# EasyEDA Pro project ProPrj_25电赛_2025-07-31.epro, board PCB1
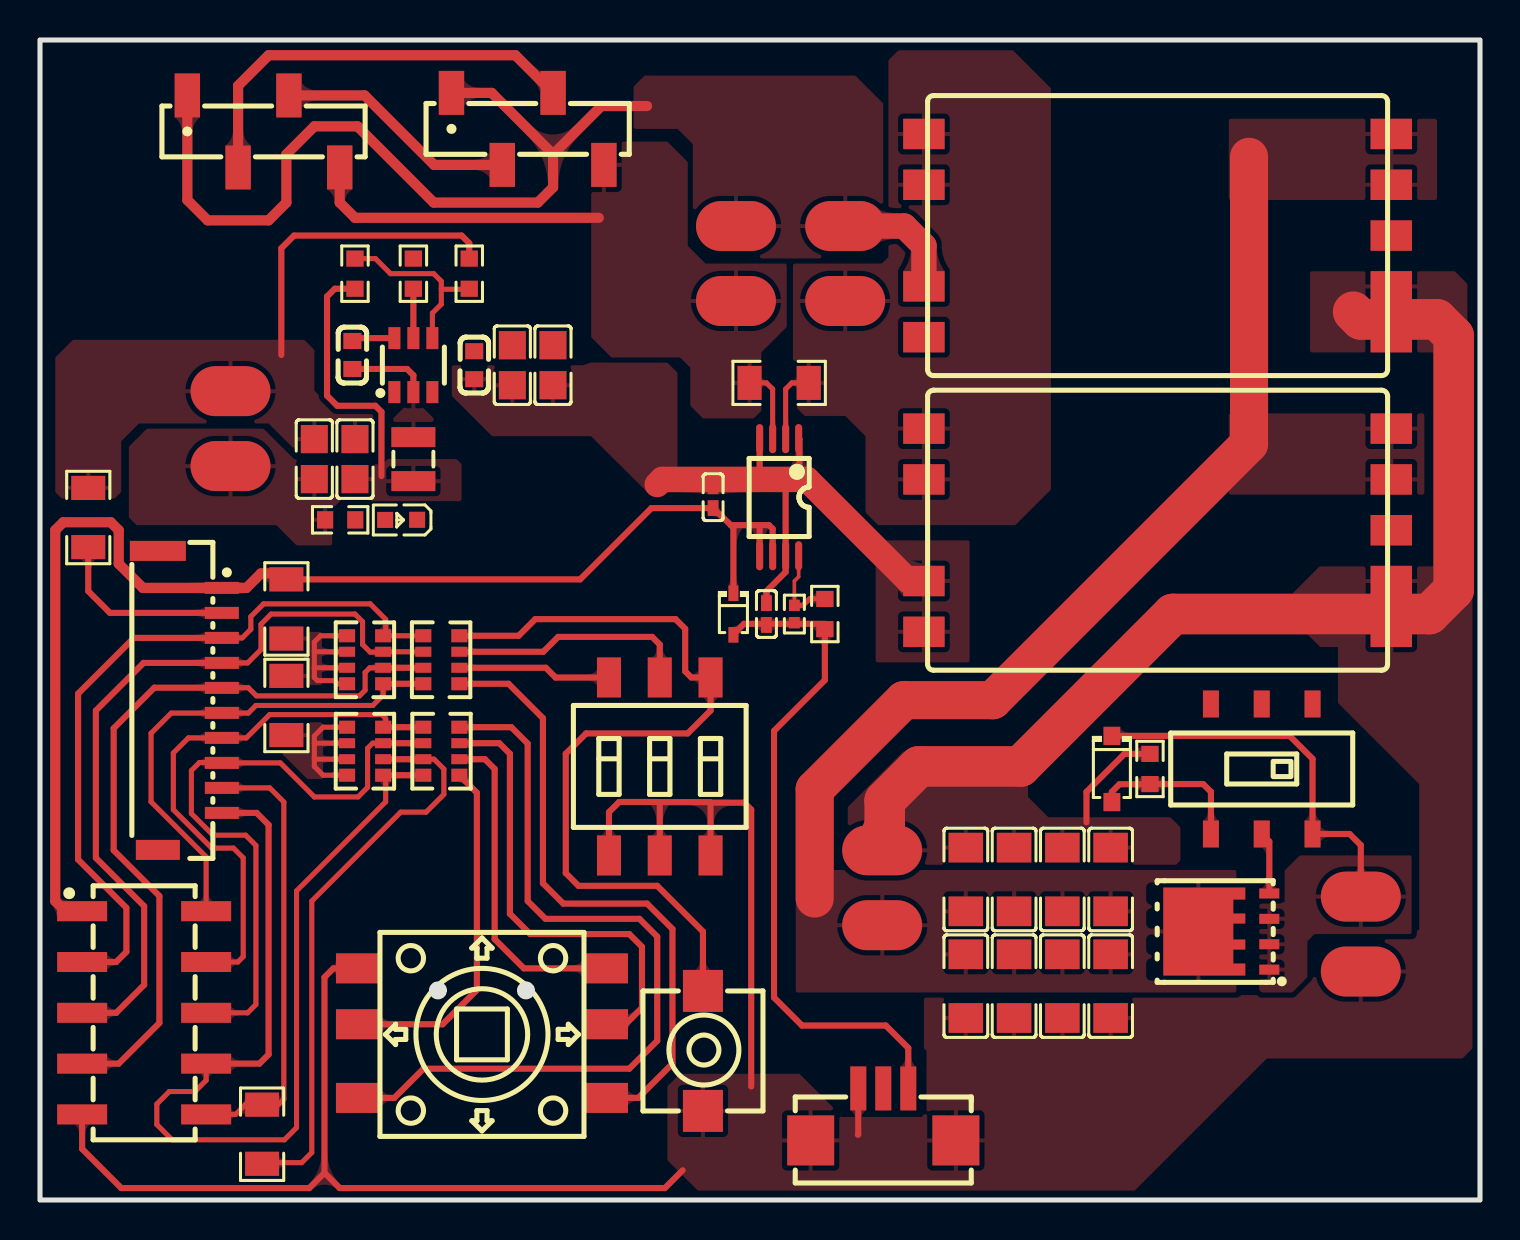
[diagram p3: board, top side]
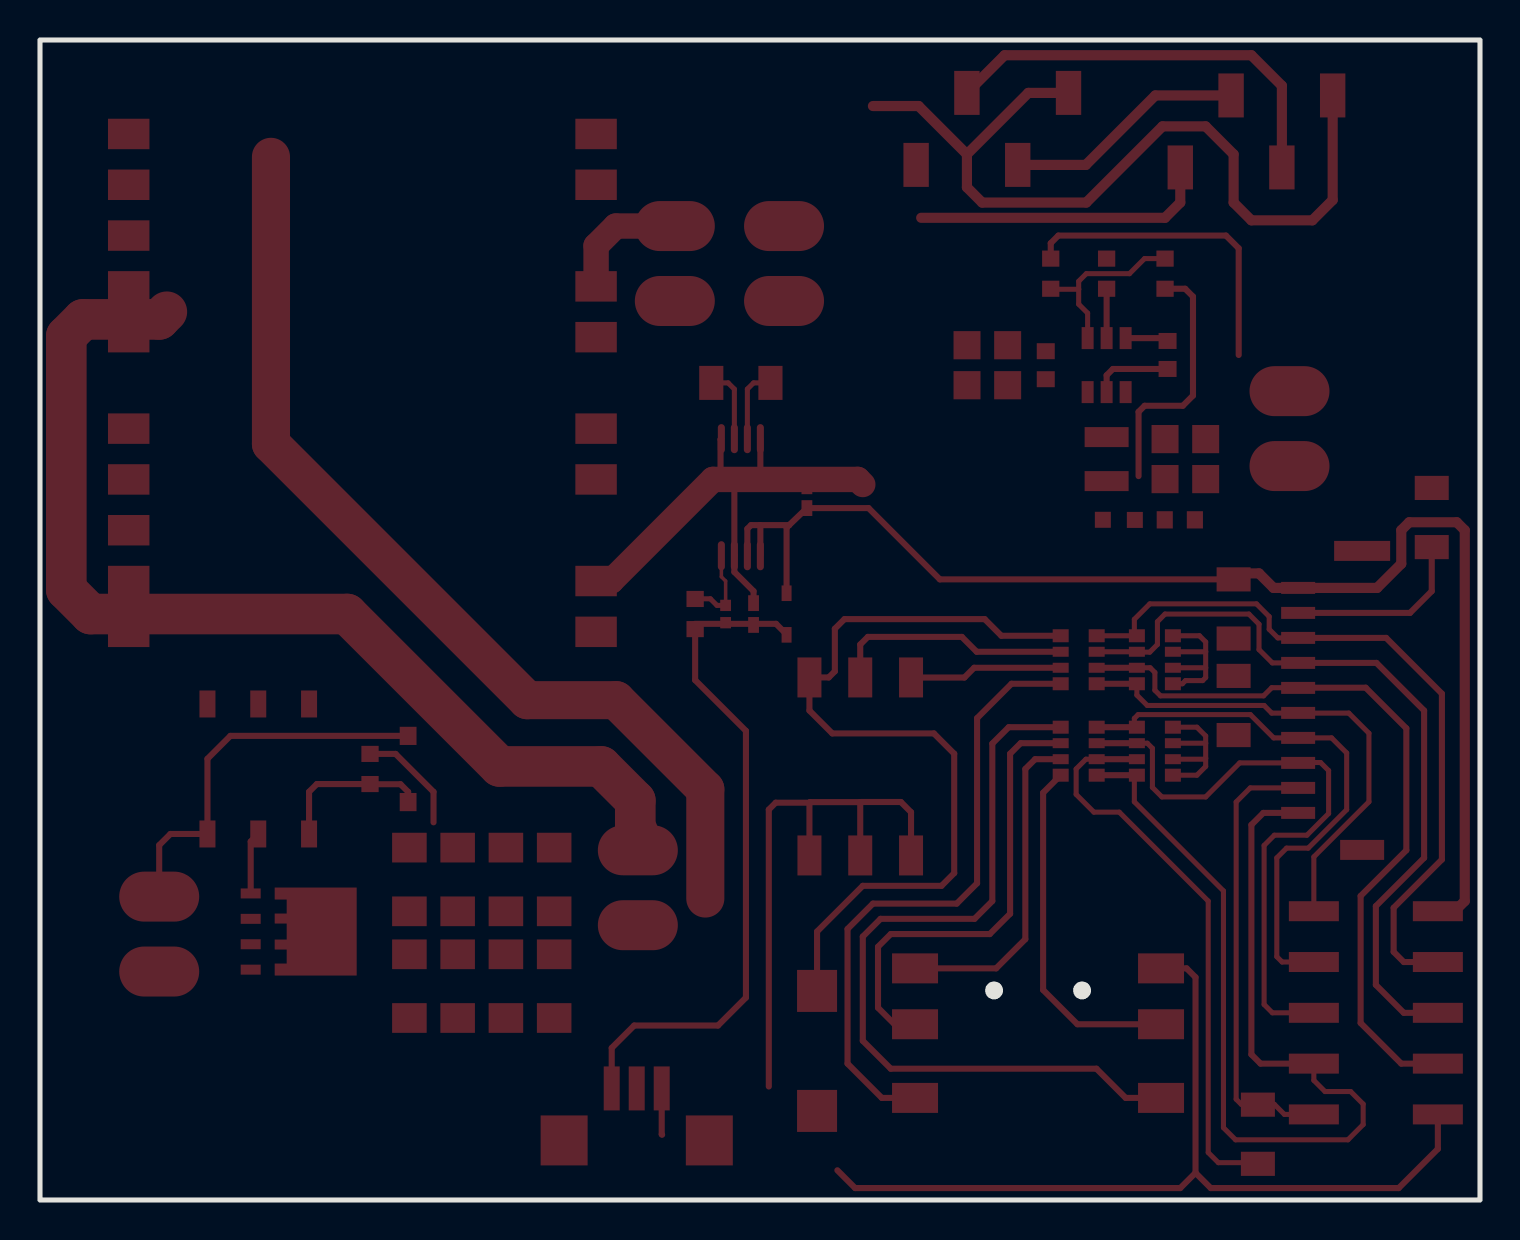
[diagram p4: board, bottom side, seen from below]

Outline 72 x 58 mm; copper layers: Top Layer, Bottom Layer. Coordinates in mm from the lower left corner of the outline.
Outline path: rectangle 0,58 72,0
Stack: Top Layer 0.035mm / Dielectric1 1.51mm FR4 er 4.5 / Bottom Layer 0.035mm

## Design rules (mm)
template: 自定义配置
spacing copperThickness1oz (default): track to track 0.203, other pairs 0.152 to 0.3
spacing copperThickness2oz: track to track 0.203, other pairs 0.152 to 0.3
track width copperThickness1oz (default): min 0.127, default 0.305, max 2.54
track width copperThickness2oz: min 0.203, default 0.254, max 2.54
differential pair differentialPair (default): width min 0.127, default 0.254, max 2.54; gap min 0.152, default 0.152
via viaSize (default): diameter min 0.5, default 0.61, max 10; hole min 0.3, default 0.305, max 6.299

## Placement (name value [footprint] x y rotation side)
C87  100nF  [C0603]  15.62 42.25 90 top
C88  22uF  [C0805]  15.75 37.05 270 top
C89  22uF  [C0805]  13.72 37.05 270 top
C90  10uF  [C0805]  25.65 41.74 270 top
C91  10uF  [C0805]  23.62 41.74 270 top
C92  100nF  [C0603]  21.71 41.74 270 top
C94  22uF  [c1206]  51.12 10.69 90 top
C95  22uF  [c1206]  53.53 10.69 90 top
C96  22uF  [c1206]  53.53 16.03 270 top
C133  22uF  [c1206]  46.29 10.69 90 top
C134  22uF  [c1206]  48.7 10.69 90 top
C135  22uF  [c1206]  48.7 16.03 270 top
C136  22uF  [c1206]  46.29 16.03 270 top
C142  22uF  [c1206]  51.12 16.03 270 top
C148  100nF  [C0402]  33.66 35.14 90 top
C167  100nF  [C0402]  36.32 29.3 270 top
CN10  HC-1.25-3PWT  [CONN-SMD_HC-1.25-3PWT]  42.16 4.28 0 top
D2  BZT52C16  [SOD-123_L2.7-W1.7-LS3.8-RD]  53.59 21.55 270 top
D31  1N4148WS  [SOD-323_L1.7-W1.3-LS2.5-FD]  34.67 29.3 90 top
H1  B-2100N10P-B110  [HDR-SMD_10P-P2.54-V-M-R2-C5-S2.54-LS7.3]  5.21 9.36 270 top
H2  X6511WVS-04H-C60D48R1  [HDR-SMD_4P-P2.54-V-M-S4.8]  11.18 53.43 0 top
H3  X6511WVS-04H-C60D48R1  [HDR-SMD_4P-P2.54-V-M-S4.8]  24.38 53.56 0 top
L5  2.2uH  [IND-SMD_L2.5-W2.0_MHCHL2520]  18.67 37.05 90 top
LED7  NCD0603R1  [LED0603-RD_RED]  18.06 34.01 180 top
Q11  TPH1R403NL  [POWERVDFN-8_L6.2-W5.2-P1.27-LS6.0-BL]  59.69 13.42 90 top
R10  10K  [R0603]  55.5 21.55 270 top
R135  4.7K  [R0603]  15.01 34.01 180 top
R136  10kΩ  [R0603]  18.67 46.32 270 top
R137  10kΩ  [R0603]  21.46 46.32 270 top
R138  33.2kΩ  [R0603]  15.75 46.32 90 top
R189  10mΩ  [R1206]  36.96 40.86 0 top
R196  150kΩ  [R0402]  37.72 29.3 270 top
R198  0Ω  [R0603]  39.24 29.3 90 top
R199  0Ω  [R1206]  12.32 24.73 90 top
R200  0Ω  [R1206]  12.32 29.55 90 top
R201  0Ω  [R1206]  11.11 3.29 90 top
R202  0Ω  [R1206]  2.41 34.12 90 top
RN3  100Ω  [RES-ARRAY-SMD_0603-8P-L3.2-W1.6-BL]  20.07 27.01 90 top
RN4  100Ω  [RES-ARRAY-SMD_0603-8P-L3.2-W1.6-BL]  20.07 22.44 270 top
RN5  1kΩ  [RES-ARRAY-SMD_0603-8P-L3.2-W1.6-BL]  16.26 27.01 90 top
RN6  1kΩ  [RES-ARRAY-SMD_0603-8P-L3.2-W1.6-BL]  16.26 22.44 90 top
SW1  SS-3235S-L3  [SW-SMD_SS-3235S-L3.00]  61.09 21.55 0 top
SW3  DSIC03LS-P  [SW-SMD_6P-L8.6-W6.2-P2.54-LS9.8]  30.99 21.68 0 top
SW5  K1-1504SA-06  [SW-SMD_K1-1504SA-06]  22.1 8.34 0 top
U5V  -  [逐飞电源]  55.88 33.49 270 top
U5V1  -  [逐飞电源]  55.88 48.22 270 top
U32  TPS563201DDCR  [SOT-23-6_L2.9-W1.6-P0.95-LS2.8-BR]  18.67 41.74 270 top
U60  -  [2P焊接端子（大电流）]  9.53 38.57 180 top
U61  INA240A2PWR  [TSSOP-8_L4.4-W3.0-P0.65-LS6.4-BL]  36.96 35.14 180 top
U65  -  [2P焊接端子（大电流）]  34.8 46.82 180 top
U66  -  [2P焊接端子（大电流）]  42.11 15.61 180 top
U67  -  [2P焊接端子（大电流）]  66.04 13.3 0 top
U72  SKPMAQE010  [KEY-SMD_2P-L6.0-W6.0-P6.00]  33.15 7.45 270 top
U73  WAFER-GH1.25-10PWB  [CONN-SMD_10P-P1.25_XUNPU_WAFER-GH1.25-10PWB]  7.49 24.98 270 top
U74  -  [2P焊接端子（大电流）]  40.26 46.82 180 top

## Footprints (pads in the part's own frame, mm; a bottom-side part is the same pattern mirrored in y, then rotated)
2P焊接端子（大电流）
  oval 4x2.5 smd: 1(0,1.873) 2(0,-1.873)
C0402
  rect 0.79x0.54 smd: 1(-0.545,0) 2(0.545,0)
C0603
  rect 0.8x0.9 smd: 1(-0.7,0) 2(0.7,0)
C0805
  rect 1.41x1.35 smd: 1(-1,0) 2(1,0)
c1206
  rect 1.485x1.728 smd: 1(-1.593,0) 2(1.593,0)
CONN-SMD_10P-P1.25_XUNPU_WAFER-GH1.25-10PWB
  rect 0.6x1.7 smd: 1(-5.625,1.6) 2(-4.375,1.6) 3(-3.125,1.6) 4(-1.875,1.6) 5(-0.625,1.6) 6(0.625,1.6) 7(1.875,1.6) 8(3.125,1.6) 9(4.375,1.6) 10(5.625,1.6)
  rect 1x2.2 smd: 11(7.475,-1.6)
  rect 1x2.8 smd: 12(-7.475,-1.6)
CONN-SMD_HC-1.25-3PWT
  rect 0.8x2.2 smd: 1(-1.25,1.3) 2(0,1.3) 3(1.25,1.3)
  rect 2.35x2.5 smd: 4(-3.63,-1.3) 5(3.63,-1.3)
HDR-SMD_4P-P2.54-V-M-S4.8
  rect 1.27x2.2 smd: 1(-3.81,1.8) 2(-1.27,-1.8) 3(1.27,1.8) 4(3.81,-1.8)
HDR-SMD_10P-P2.54-V-M-R2-C5-S2.54-LS7.3
  rect 1x2.5 smd: 1(-5.08,-3.1) 2(-5.08,3.1) 3(-2.54,-3.1) 4(-2.54,3.1) 5(0,-3.1) 6(0,3.1) 7(2.54,-3.1) 8(2.54,3.1) 9(5.08,-3.1) 10(5.08,3.1)
IND-SMD_L2.5-W2.0_MHCHL2520
  rect 1x2.2 smd: 1(-1.1,0) 2(1.1,0)
KEY-SMD_2P-L6.0-W6.0-P6.00
  rect 2.1x2 smd: 1(-3,0) 2(3,0)
LED0603-RD_RED
  rect 0.8x0.8 smd: 1(-0.799,-0.004) 2(0.799,0.004)
POWERVDFN-8_L6.2-W5.2-P1.27-LS6.0-BL
  rect 0.5x1 smd: 1(-1.905,-1.775) 2(-0.635,-1.775) 3(0.635,-1.775) 4(1.905,-1.775)
  custom 4.4x4.1 smd: 5(0,1.775)
R0402
  rect 0.566x0.54 smd: 1(-0.433,0) 2(0.433,0)
R0603
  rect 0.806x0.864 smd: 1(-0.753,0) 2(0.753,0)
R1206
  rect 1.208x1.701 smd: 1(-1.479,0) 2(1.479,0)
RES-ARRAY-SMD_0603-8P-L3.2-W1.6-BL
  rect 0.65x0.8 smd: 1(-1.2,-0.9) 4(1.2,-0.9) 5(1.2,0.9) 8(-1.2,0.9)
  rect 0.5x0.8 smd: 2(-0.4,-0.9) 3(0.4,-0.9) 6(0.4,0.9) 7(-0.4,0.9)
SOD-123_L2.7-W1.7-LS3.8-RD
  rect 0.91x0.84 smd: 1(-1.655,0) 2(1.655,0)
SOD-323_L1.7-W1.3-LS2.5-FD
  rect 0.78x0.5 smd: 1(-1.04,0) 2(1.04,0)
SOT-23-6_L2.9-W1.6-P0.95-LS2.8-BR
  rect 1.1x0.6 smd: 1(1.35,-0.95) 2(1.35,0) 3(1.35,0.95) 4(-1.35,0.95) 5(-1.35,0) 6(-1.35,-0.95)
SW-SMD_6P-L8.6-W6.2-P2.54-LS9.8
  rect 1.2x2 smd: 1(-2.54,-4.45) 2(0,-4.45) 3(2.54,-4.45) 4(2.54,4.45) 5(0,4.45) 6(-2.54,4.45)
SW-SMD_K1-1504SA-06
  rect 2.3x1.5 smd: 1(-6.15,3.239) 2(-6.15,0.445) 3(-6.15,-3.239) 4(6.15,3.239) 5(6.15,0.445) 6(6.15,-3.239)
SW-SMD_SS-3235S-L3.00
  rect 0.8x1.35 smd: 1(-2.54,3.25) 2(0,3.25) 3(2.54,3.25) 4(-2.54,-3.25) 5(0,-3.25) 6(2.54,-3.25)
TSSOP-8_L4.4-W3.0-P0.65-LS6.4-BL
  oval 0.353x1.454 smd: 1(-0.975,-2.927) 2(-0.325,-2.927) 3(0.325,-2.927) 4(0.975,-2.927) 5(0.975,2.927) 6(0.325,2.927) 7(-0.325,2.927) 8(-0.975,2.927)
逐飞电源
  custom 1.524x2.073 smd: 1(5.08,11.684)
  custom 1.525x2.073 smd: 2(2.54,11.684) 3(0,11.684) 4(-2.54,11.684) 5(-5.08,11.684) 6(-5.08,-11.684) 7(-2.54,-11.684) 8(2.54,-11.684) 9(5.08,-11.684)

## Nets
As in the schematic.

Pads without a net: CN10 2; SW1 1 2 3; U5V 3; U5V1 3; U73 11 12

## Routing (per net, layer and track width the routed paths; a pad name or vN(x,y) marks a point on that pad's centre or on a via; arc(x,y) is an arc through that point)
+5V_IN: length 3.8
  Top Layer w0.254: U61.2 37.28,40.55 37.59,40.86 R189.2
GND: length 234.8
  Top Layer w0.305: 37.21,35.78 37.28,35.7 U61.7 37.28,31.4 36.32,30.44 C167.1 ; 12.06,42.25 12.06,47.59 12.7,48.22 21.08,48.22 21.46,47.84 R137.1 ; U61.4 35.98,36.54 ; 14.22,1.36 13.46,0.6 4.06,0.6 2.11,2.55 H1.9 ; 14.22,1.36 14.22,11.14 14.67,11.58 15.69,11.58 ; 14.22,1.36 14.99,0.6 31.24,0.6 32.13,1.49 ; SW3.2 30.99,19.89 ; 30.99,19.89 33.5,19.89 33.53,19.87 ; 30.99,19.89 30.98,19.9 28.96,19.9 28.45,19.39 SW3.1 ; 35.56,5.68 35.56,19.52 35.21,19.87 33.53,19.87 ; SW3.3 33.53,19.87 ; 37.97,36.41 37.97,38.03 U61.1 ; 40.89,3.26 40.91,3.28 CN10.1 ; 2.29,32.6 2.41,32.47 2.41,30.44 3.5,29.36 U73.2 ; R10.1 54.22,22.3 52.32,20.41 52.32,18.88
  Top Layer w0.508: 30.35,54.7 28.07,54.7 25.65,52.28 ; 25.65,52.28 22.58,55.36 H3.1 ; 25.65,52.28 25.65,50.63 24.89,49.87 19.69,49.87 15.88,53.68 13.72,53.68 12.32,52.28 12.32,49.87 11.43,48.98 8.38,48.98 7.37,50 H2.1
  Top Layer w1.27: U5V1.8 44.2,47.71 43.21,48.7 U74.2 ; 30.86,35.77 31.12,36.03 38.35,36.03 43.43,30.95 U5V.8 ; U66.2 42.11,18.41
  Top Layer w2.032: 42.11,18.41 42.24,18.53 42.24,19.97 43.94,21.68 49.02,21.68 56.64,29.3 69.47,29.3 70.68,30.51 70.68,43.2 69.85,44.03 66.04,44.03 65.66,44.41
VCC_3V3: length 97.9
  Top Layer w0.254: 13.72,22.84 15.48,22.84 ; 13.72,22.84 13.72,23.2 14.15,23.64 15.48,23.64 ; 13.72,22.84 13.72,22.08 ; 15.48,22.04 13.76,22.04 13.72,22.08 ; 13.72,22.08 13.72,21.68 14.15,21.24 15.48,21.24 ; 13.72,27.41 15.48,27.41 ; 13.72,27.41 13.72,26.61 ; 13.72,27.41 13.72,27.9 14.03,28.21 15.48,28.21 ; 13.72,26.61 13.72,26.12 13.87,25.97 14.72,25.97 14.88,25.81 15.48,25.81 ; 13.72,26.61 15.48,26.61
  Top Layer w0.305: 36.01,33.74 34.54,33.74 ; 36.01,33.74 35.98,33.72 U61.5 ; 36.01,33.74 36.45,33.74 36.63,33.56 U61.6 ; 34.54,33.74 34.67,33.62 D31.2 ; 34.54,33.74 C148.1 30.57,34.59 27.01,31.03 R200.2 ; 17.07,36.2 17.07,39.41 16.77,39.71 14.86,39.71 14.35,40.22 14.35,45.17 14.74,45.56 R138.1
  Top Layer w0.508: 9.22,30.61 10.32,30.61 11.05,31.33 12.02,31.33 R200.2 ; H1.1 1.27,14.44 0.76,14.95 0.76,33.49 1.16,33.89 3.54,33.89 3.94,33.49 3.94,31.81 5.14,30.61 U73.1
VCC_5V: length 18.8
  Top Layer w0.254: U61.3 36.63,40.55 36.32,40.86 R189.1
  Top Layer w0.508: H2.4 14.99,49.87 15.75,49.11 27.94,49.11
VCC_BAT: length 18.6
  Top Layer w0.305: 66.04,16.09 66.04,17.74 65.48,18.3 63.63,18.3 63.63,22.06 62.48,23.21 D2.1
VCC_IN: length 48.7
  Top Layer w1.905: 60.45,52.16 60.45,37.81 47.64,24.99 43.19,24.99 38.74,20.53 38.74,15.07
C10: length 36.8
  Top Layer w0.254: RN3.5 17.28,28.21 17.28,29.03 16.51,29.81 11.18,29.81 10.54,29.17 10.54,28.54 10.11,28.11 9.22,28.11
  Top Layer w0.305: U73.3 4.69,28.11 1.91,25.32 1.91,17.02 4.32,14.61 4.32,12.41 3.81,11.9 H1.3
C11: length 27.9
  Top Layer w0.254: 17.28,23.64 17.28,24.08 17.09,24.27 11.48,24.27 10.32,23.11 9.22,23.11 ; 8.31,11.9 9.89,11.9 10.16,12.17 10.16,17.11 9.67,17.59 8.59,17.59 6.67,19.52 6.67,22.35 7.42,23.11 U73.7
  Top Layer w0.305: 17.28,23.64 RN4.1
C12: length 51.1
  Top Layer w0.254: 8.31,6.82 8.31,5.98 7.75,5.42 6.47,5.42 5.84,4.8 5.84,3.77 6.6,3.01 12.22,3.01 12.83,3.62 12.83,15.45 17.28,19.91 17.28,21.24
  Top Layer w0.305: U73.10 10.83,19.36 11.43,18.76 11.43,7.28 10.97,6.82 8.31,6.82 ; RN4.4 17.28,21.24
C13: length 50.8
  Top Layer w0.254: RN4.3 19.7,22.04 20.19,21.55 20.19,20.28 19.3,19.39 18.03,19.39 13.59,14.95 13.59,2.37 13.08,1.87 11.8,1.87 11.36,1.43 ; U73.9 11.49,20.61 12.19,19.9 12.19,5.04 11.94,4.79 10.29,4.79 9.78,4.28 8.31,4.28
  Top Layer w0.305: 17.28,22.04 RN4.3
C14: length 31.3
  Top Layer w0.254: 8.31,9.36 10.38,9.36 10.8,9.78 10.8,17.73 10.28,18.24 8.65,18.24 7.57,19.32 7.57,21.47 7.97,21.87 9.07,21.87 U73.8 ; 9.22,21.86 12.02,21.86 13.72,20.15 15.9,20.15 16.38,20.63 16.38,22.59 16.63,22.84 17.28,22.84
  Top Layer w0.305: 17.28,22.84 RN4.2
C15: length 24.9
  Top Layer w0.254: 8.31,14.44 8.31,17.16 5.55,19.91 5.55,23.34 6.56,24.34 10.41,24.34 10.8,24.73 16.64,24.73 17.16,25.25 RN5.1
  Top Layer w0.305: RN3.8 17.28,25.81
C26: length 37.7
  Top Layer w0.254: U73.5 9.1,25.61 ; 9.23,25.61 10.41,25.61 10.82,25.21 15.98,25.21 16.26,25.49 16.26,26.38 16.49,26.61 RN5.2
  Top Layer w0.305: 9.1,25.61 5.72,25.61 3.68,23.58 3.68,17.49 5.97,15.2 5.97,8.85 3.94,6.82 H1.7 ; 17.28,26.61 RN3.7
C27: length 38.8
  Top Layer w0.254: 9.22,26.86 10.38,26.86 11.05,27.52 11.05,28.79 11.56,29.3 15.75,29.3 16.13,28.92 16.13,27.77 16.51,27.39 17.14,27.39 RN5.3 RN3.6
  Top Layer w0.305: U73.4 5.18,26.86 2.79,24.47 2.79,17.11 5.21,14.69 5.21,10.76 3.81,9.36 H1.5
I_OUT: length 33.9
  Top Layer w0.305: CN10.3 43.41,7.6 42.29,8.72 38.1,8.72 36.7,10.12 36.7,23.46 39.24,26 R198.1 ; 34.75,28.36 35.2,28.81 39.25,28.81
$1N731: length 4.2
  Top Layer w0.178: U61.8 37.93,31.16 37.72,30.95 R196.1
  Top Layer w0.254: R198.2 39.23,30.06 38.48,30.06 38.15,29.73 R196.1
$1N2882: length 42.2
  Top Layer w0.305: RN3.4 23.93,28.21 24.76,29.04 31.78,29.04 32.26,28.56 32.26,26.43 32.56,26.13 SW3.4 33.53,24.47 32.38,23.33 27.31,23.33 26.29,22.31 26.29,16.34 26.92,15.71 30.86,15.71 33.15,13.42 U72.1
$1N2883: length 12.1
  Top Layer w0.305: SW3.5 30.99,27.77 30.61,28.16 25.91,28.16 25.16,27.41 RN3.3
$1N2884: length 7.7
  Top Layer w0.305: SW3.6 28.44,26.12 25.78,26.12 25.29,26.61 RN3.2
$1N2885: length 31.8
  Top Layer w0.305: 27.87,5.1 29.91,5.1 31.62,6.82 31.62,13.55 30.35,14.82 26.16,14.82 25.15,15.84 25.15,24.09 23.43,25.81 RN3.1
$1N2886: length 40.5
  Top Layer w0.305: RN4.8 23.56,23.64 24.38,22.82 24.38,14.95 25.27,14.06 29.97,14.06 30.86,13.17 30.86,7.96 29.46,6.56 19.18,6.56 17.72,5.1 15.57,5.1
$1N2887: length 23.7
  Top Layer w0.305: 27.87,8.79 29.27,8.79 30.1,9.61 30.1,12.66 29.46,13.3 24.51,13.3 23.5,14.31 23.5,22.31 22.97,22.84 RN4.7
$1N2888: length 16.2
  Top Layer w0.305: 27.87,11.58 24.19,11.58 22.73,13.04 22.73,21.55 22.24,22.04 RN4.6
$1N2889: length 18.1
  Top Layer w0.305: 15.57,8.79 20.13,8.79 21.84,10.5 21.84,20.36 RN4.5
$1N3612: length 12.1
  Top Layer w0.508: H3.2 19.71,51.75 16.23,55.23 H2.3
$1N3618: length 21.2
  Top Layer w0.508: H2.2 9.91,55.71 11.43,57.24 23.77,57.24 H3.3
$1N4092: length 3.1
  Top Layer w0.305: SW1.5 61.47,17.92 Q11.4
$1N4142: length 7.9
  Top Layer w0.305: D2.2 53.59,20.41 53.97,20.79 55.49,20.79 R10.2 58.16,20.8 58.55,20.41 SW1.4
$1N4863: length 4
  Top Layer w0.305: U32.2 18.67,41.24 18.35,41.55 C87.1
$1N4868: length 2.2
  Top Layer w0.305: C87.2 15.76,43.09 U32.6
$1N4869: length 2.5
  Top Layer w0.305: R136.2 U32.5
$1N4871: length 9.2
  Top Layer w0.254: R137.2 21.44,45.54 20.07,45.54 ; 20.07,45.54 20.07,45.94 19.69,46.32 17.53,46.32 16.77,47.07 R138.2 ; 20.07,45.54 20.07,44.79 19.62,44.34 U32.4

## Copper pours and planes (outline as drawn; the poured copper is in the pictures)
+5V_IN on Top Layer: 37.65,46.82 37.65,41.81 37.85,41.62 37.85,39.58 38.23,39.2 40.26,39.2 41.28,38.19 41.28,34.38 41.91,33.74 48.77,33.74 50.55,35.52 50.55,55.59 48.64,57.49 42.93,57.49 42.42,56.98 42.42,47.15 42.09,46.82
GND on Top Layer: 40.39,19.65 40.39,16.34 40.64,16.09 56.13,16.09 57.02,16.98 57.02,18.63 56.51,19.14 50.42,19.14 49.4,20.15 49.4,22.19 49.66,22.44 43.18,22.44
GND on Top Layer: 44.2,10.25 44.2,7.58 44.7,7.07 71.12,7.07 71.63,7.58 71.63,31.2 71.25,31.58 65.28,31.58 64.9,31.2 64.9,24.85 68.96,20.79 68.96,13.55 68.71,13.3 63.63,13.3 63.37,13.04 63.37,11.01 62.61,10.25
GND on Top Layer: 31.37,5.68 31.37,1.99 32.89,0.47 54.73,0.47 62.1,7.84 44.58,7.84 44.32,7.58 44.32,4.41 44.07,4.15 40.13,4.15 37.97,6.31 32,6.31
GND on Top Layer: 63.5,46.44 63.5,42.38 71.37,42.38 71.37,45.81 70.74,46.44
GND on Top Layer: 29.68,53.56 31.88,53.56 32.64,52.79 32.64,47.97 33.53,47.08 41.66,47.08 42.16,47.59 42.16,54.83 40.77,56.22 30.23,56.22 29.68,55.67
GND on Top Layer: 41.78,32.98 46.48,32.98 46.48,26.89 41.78,26.89
GND on Top Layer: -4.32,36.79 -13.16,36.79 -13.16,43.52 -4.32,43.52
GND on Top Layer: 62.61,30.31 63.98,31.68 69.95,31.68 70.99,32.73 70.99,33.23 71.37,33.23 71.37,28.28 70.74,27.65 64.01,27.65 62.61,29.04
GND on Top Layer: 20.59,41.75 20.59,40.2 22.61,38.19 27.56,38.19 30.35,35.39 31.88,35.39 31.88,41.36 31.37,41.87 27.55,41.87 27.18,41.74 20.59,41.74
GND on Top Layer: 17.27,39.33 17.27,37.31 17.01,37.05 13.21,37.05 11.43,38.82 4.95,38.82 4.06,37.93 4.06,35.4 3.74,35.08 1.08,35.08 0.76,35.39 0.76,42.12 1.65,43.01 13.21,43.01 13.72,42.51 13.72,40.47 14.35,39.84 16.76,39.84
VCC_3V3 on Top Layer: 11.48,22.64 13.08,21.04 14.1,21.04 14.15,21.1 14.15,23.78 13.97,23.96 11.48,23.96
VCC_3V3 on Top Layer: 11.05,28.41 14.1,28.41 14.1,25.74 11.05,25.74
VCC_3V3 on Top Layer: 12.7,37.05 11.18,38.57 5.35,38.57 4.44,37.67 4.44,34.12 4.83,33.74 11.81,33.74 12.83,32.73 14.61,32.73 14.61,34.54 15.01,34.94 21.01,34.94 21.08,35.01 21.08,36.79 20.83,37.05
VCC_5V on Top Layer: 27.56,52.92 27.56,43.14 28.57,42.12 32,42.12 32.51,41.62 32.51,39.71 33.15,39.08 35.69,39.08 36.07,39.46 36.07,42.38 37.34,43.65 37.34,46.82 33.27,46.82 32.38,47.71 32.38,51.9 31.37,52.92
VCC_BAT on Top Layer: 60.96,10.5 61.09,10.38 62.61,10.38 63.37,11.14 63.37,12.94 63.73,13.3 68.58,13.3 68.58,17.23 62.99,17.23 62.23,16.47 62.23,14.9 61.13,14.9 60.96,14.73
VCC_IN on Top Layer: 37.79,16.5 59.82,16.5 59.82,10.38 37.79,10.38
VCC_IN on Top Layer: 59.44,54.06 69.85,54.06 69.85,50 59.44,50
VCC_IN on Top Layer: 59.44,39.33 69.22,39.33 69.22,35.27 59.44,35.27
$1N4863 on Top Layer: 17.65,38.57 17.65,39.08 18.29,39.71 18.29,40.34 18.56,40.61 18.69,40.47 18.92,40.47 18.92,40.32 19.02,40.32 19.05,40.35 19.05,39.71 19.69,39.08 19.69,38.19 19.56,38.06 18.75,38.06 18.67,38.14 18.08,38.14

Small or netless copper shapes (teardrops, artwork), in the pictures only: 146 on Top Layer
